# EAGLE design SCH (EAGLE 7.2.0)
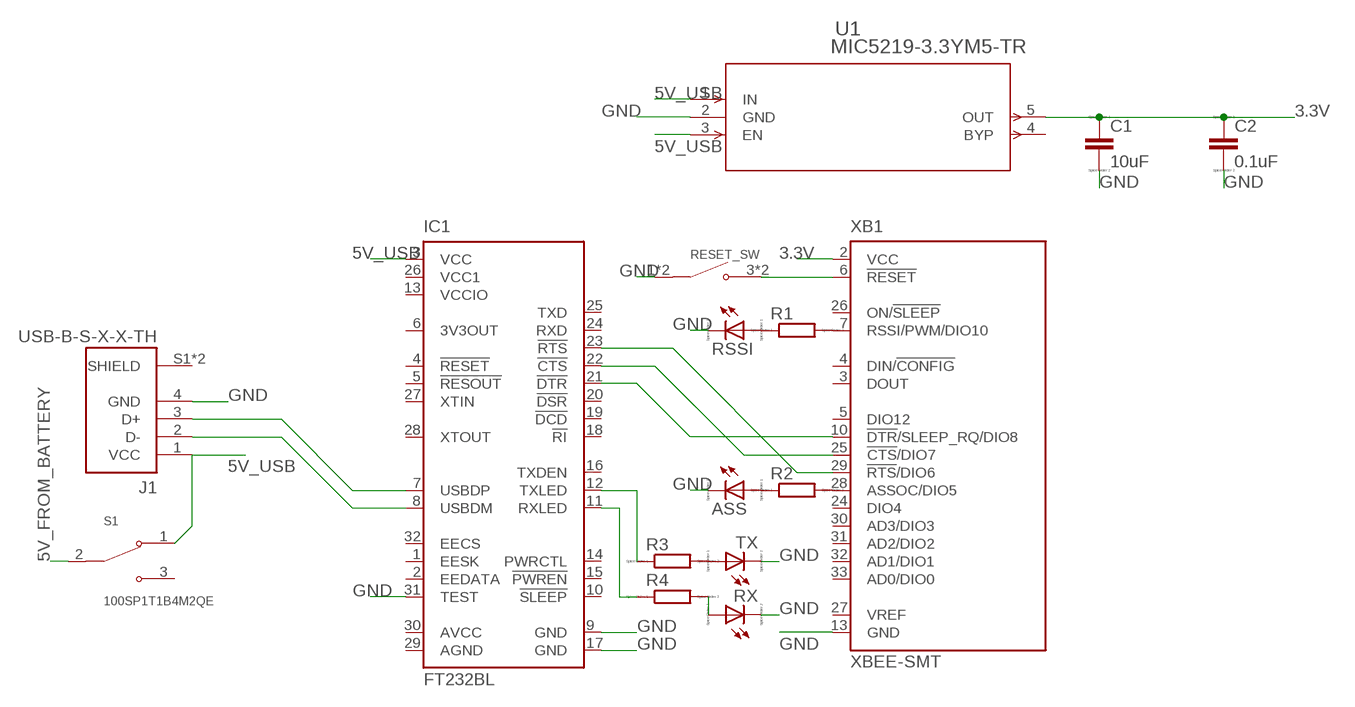
[diagram p0: schematic, sheet 1]

## Parts
ASS  LED_E  [LED_1206]
C1  10uF  C  [C0805]
C2  0.1uF  C  [C0805]
IC1  FT232BL  [LQFP32-7X7]
J1  USB-B-S-X-X-TH  [SAMTEC_USB-B-S-X-X-TH]
R1  R  [R0805]
R2  R  [R0805]
R3  R  [R0805]
R4  R  [R0805]
RESET_SW  5-1437565-0  [SW_5-1437565-0]
RSSI  LED_E  [LED_1206]
RX  LED_E  [LED_1206]
S1  100SP1T1B4M2QE  [SW_100SP1T1B4M2QE]
TX  LED_E  [LED_1206]
U1  MIC5219-3.3YM5-TR  [SOT-23-5_M5_MCH]
XB1  XBEE-SMT  [XBEE-SMT]

## Nets
3.3V: C1.1 C2.1 U1.5(OUT) XB1.2(VCC)
5V_FROM_BATTERY: S1.2
5V_USB: IC1.3(VCC) J1.1(VCC) S1.1 U1.1(IN) U1.3(EN)
GND: ASS.C C1.2 C2.2 IC1.9(GND) IC1.17(GND) IC1.31(TEST) J1.4(GND) RESET_SW.1(COM) RESET_SW.2(COM) RSSI.C RX.C TX.C U1.2(GND) XB1.13(GND)
N$1: RESET_SW.3(NO) RESET_SW.4(NO) XB1.6(!RESET)
N$2: R1.2 XB1.7(RSSI/PWM/DIO10)
N$3: IC1.7(USBDP) J1.3(D+)
N$4: IC1.8(USBDM) J1.2(D-)
N$5: IC1.23(!RTS) XB1.29(!RTS!/DIO6)
N$6: IC1.22(!CTS) XB1.25(!CTS!/DIO7)
N$7: IC1.21(!DTR) XB1.10(!DTR!/SLEEP_RQ/DIO8)
N$8: R1.1 RSSI.A
N$9: R2.2 XB1.28(ASSOC/DIO5)
N$10: ASS.A R2.1
N$11: R3.2 TX.A
N$12: R4.2 RX.A
N$13: IC1.12(TXLED) R3.1
N$14: IC1.11(RXLED) R4.1
Unconnected: IC1.1(EESK) IC1.2(EEDATA) IC1.4(!RESET) IC1.5(!RESOUT) IC1.6(3V3OUT) IC1.10(!SLEEP) IC1.14(PWRCTL) IC1.15(!PWREN) IC1.16(TXDEN) IC1.18(!RI) IC1.19(!DCD) IC1.20(!DSR) IC1.24(RXD) IC1.25(TXD) IC1.27(XTIN) IC1.28(XTOUT) IC1.32(EECS) J1.S1(SHIELD) J1.S2(SHIELD) S1.3 U1.4(BYP) XB1.3(DOUT) XB1.4(DIN/!CONFIG) XB1.5(DIO12) XB1.24(DIO4) XB1.26(ON/!SLEEP) XB1.27(VREF) XB1.30(AD3/DIO3) XB1.31(AD2/DIO2) XB1.32(AD1/DIO1) XB1.33(AD0/DIO0)

## Power pins joined to a net without a drawn wire
AGND: IC1.29(AGND)
AVCC: IC1.30(AVCC)
VCC1: IC1.26(VCC1)
VCCIO: IC1.13(VCCIO)

## Library data of the parts
ASS RSSI RX TX = eagle-ltspice:LED_E: LED Source: http://www.osram.convergy.de Source: www.luxeon.com Source: www.kingbright.com; SPICEMODEL: NONE; SPICEPREFIX: D; SPICETYPE: diode
C1 C2 = eagle-ltspice:C: CAPACITOR, European symbol; SPICEMODEL: NONE; SPICEPREFIX: C
IC1 = ftdichip:FT232B: USB to serial UART interface Source: DS_FT232BL_BQ.pdf; MF: FARNELL; MPN: FT232BL/TR; OC_FARNELL: unknown; OC_NEWARK: 38K1551
J1 = USB-B-S-X-X-TH:USB-B-S-X-X-TH: USB-B (USB TYPE-B) USB 2.0 Receptacle Connector 4 Position Through Hole, Right Angle Check availability <https://pricing.snapeda.com/parts/USB-B-S-S-B-TH/Samtec/view-part?ref=eda>; AVAILABILITY: In Stock; CHECK_PRICES: https://www.snapeda.com/parts/USB-B-S-S-B-TH/Samtec+Inc./view-part/?ref=eda; DESCRIPTION: USB-B (USB TYPE-B) USB 2.0 Receptacle Connector 4 Position Through Hole, Right Angle; MF: Samtec; MP: USB-B-S-S-B-TH; PACKAGE: None; PRICE: None; PURCHASE-URL: https://www.snapeda.com/api/url_track_click_mouser/?unipart_id=230656&manufacturer=Samtec&part_name=USB-B-S-S-B-TH&search_term=None; SNAPEDA_LINK: https://www.snapeda.com/parts/USB-B-S-S-B-TH/Samtec+Inc./view-part/?ref=snap
R1-R4 = eagle-ltspice:R: RESISTOR, European symbol; SPICEMODEL: NONE; SPICEPREFIX: R
RESET_SW = 5-1437565-0:5-1437565-0: Check availability <https://pricing.snapeda.com/parts/5-1437565-0/TE%20Connectivity/view-part?ref=eda>; AVAILABILITY: In Stock; CHECK_PRICES: https://www.snapeda.com/parts/5-1437565-0/TE+Connectivity+ALCOSWITCH+Switches/view-part/?ref=eda; COMMENT: 5-1437565-0; DESCRIPTION: Tactile Switch SPST-NO Top Actuated Surface Mount; EU_ROHS_COMPLIANCE: Compliant; MF: TE Connectivity; MP: 5-1437565-0; PACKAGE: None; PRICE: None; SNAPEDA_LINK: https://www.snapeda.com/parts/5-1437565-0/TE+Connectivity+ALCOSWITCH+Switches/view-part/?ref=snap
S1 = 100SP1T1B4M2QE:100SP1T1B4M2QE: Toggle Switch SPDT Through Hole Check availability <https://pricing.snapeda.com/parts/100SP1T1B4M2QE/E-Switch/view-part?ref=eda>; AVAILABILITY: In Stock; CHECK_PRICES: https://www.snapeda.com/parts/100SP1T1B4M2QE/E-Switch/view-part/?ref=eda; DESCRIPTION: Toggle Switch SPDT Through Hole; MF: E-Switch; MP: 100SP1T1B4M2QE; PACKAGE: None; PRICE: None; PURCHASE-URL: https://www.snapeda.com/api/url_track_click_mouser/?unipart_id=846138&manufacturer=E-Switch&part_name=100SP1T1B4M2QE&search_term=None; SNAPEDA_LINK: https://www.snapeda.com/parts/100SP1T1B4M2QE/E-Switch/view-part/?ref=snap
U1 = MIC5219:MIC5219-3.3YM5-TR; COPYRIGHT: Copyright (C) 2023 Ultra Librarian. All rights reserved.; MANUFACTURER_PART_NUMBER: MIC5219-3.3YM5-TR; MFR_NAME: Microchip
XB1 = xbee:XBEE-SMT: XBee(TM)/XBee-PRO(TM) ZB SMT RF Modules. Source: Digi (90002002_a.pdf) (http://www.digi.com/products/wireless-wired-embedded-solutions/zigbee-rf-modules/zigbee-mesh-module/xbee-smt.jsp#overview)

## Board
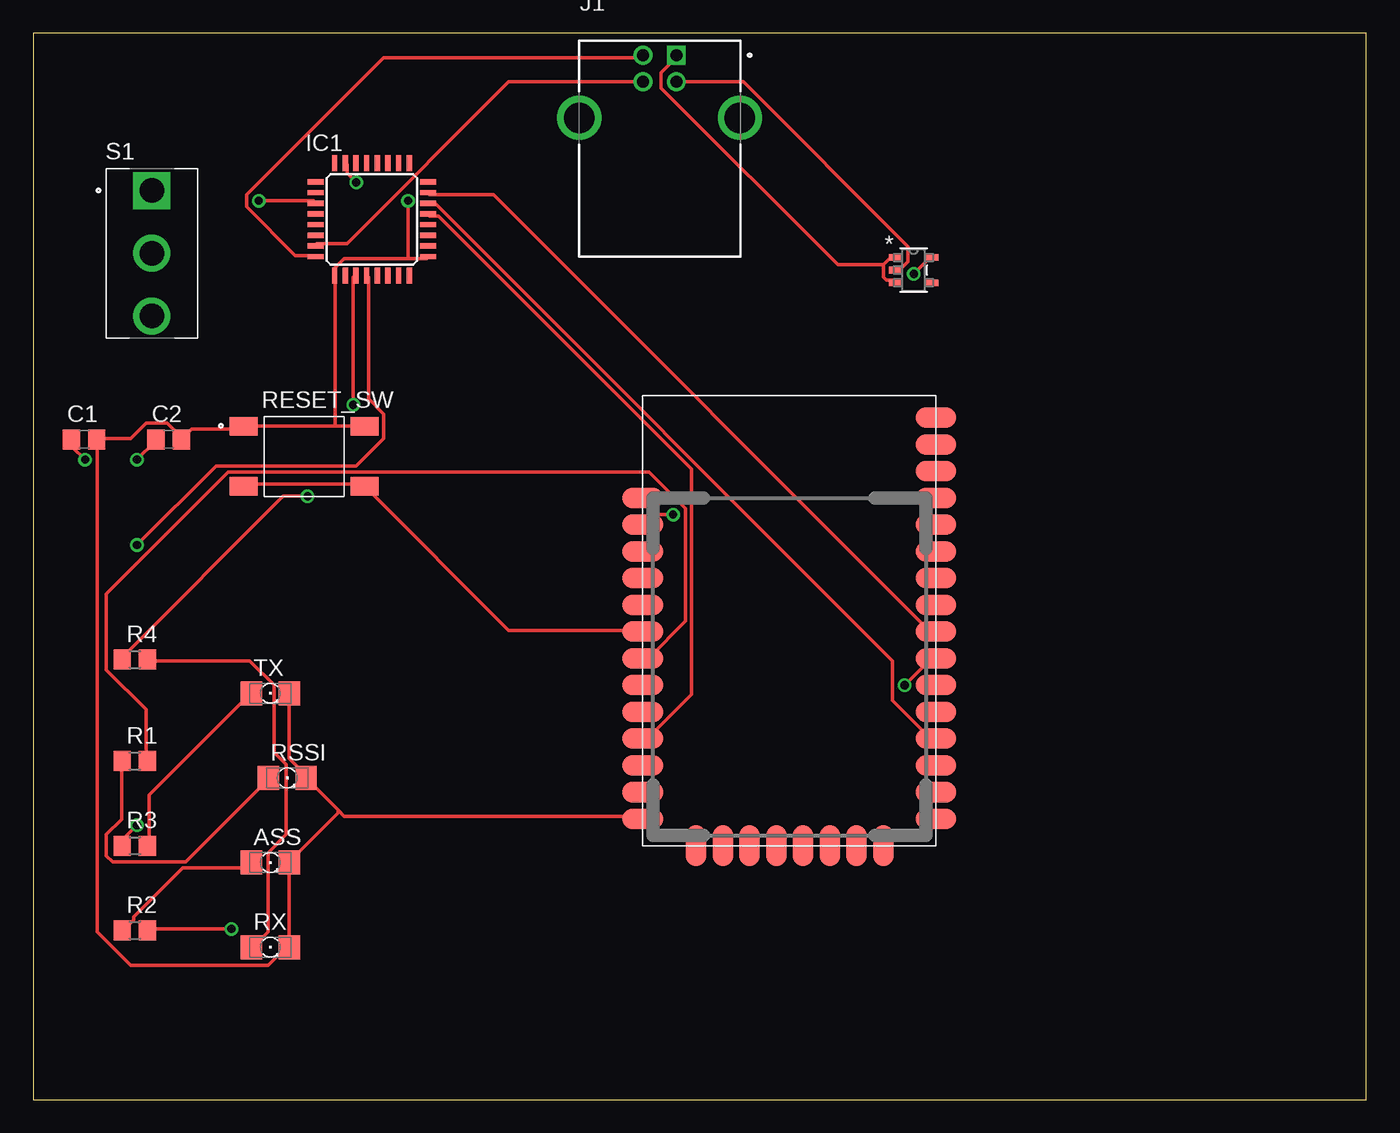
[diagram p1: board, top side]
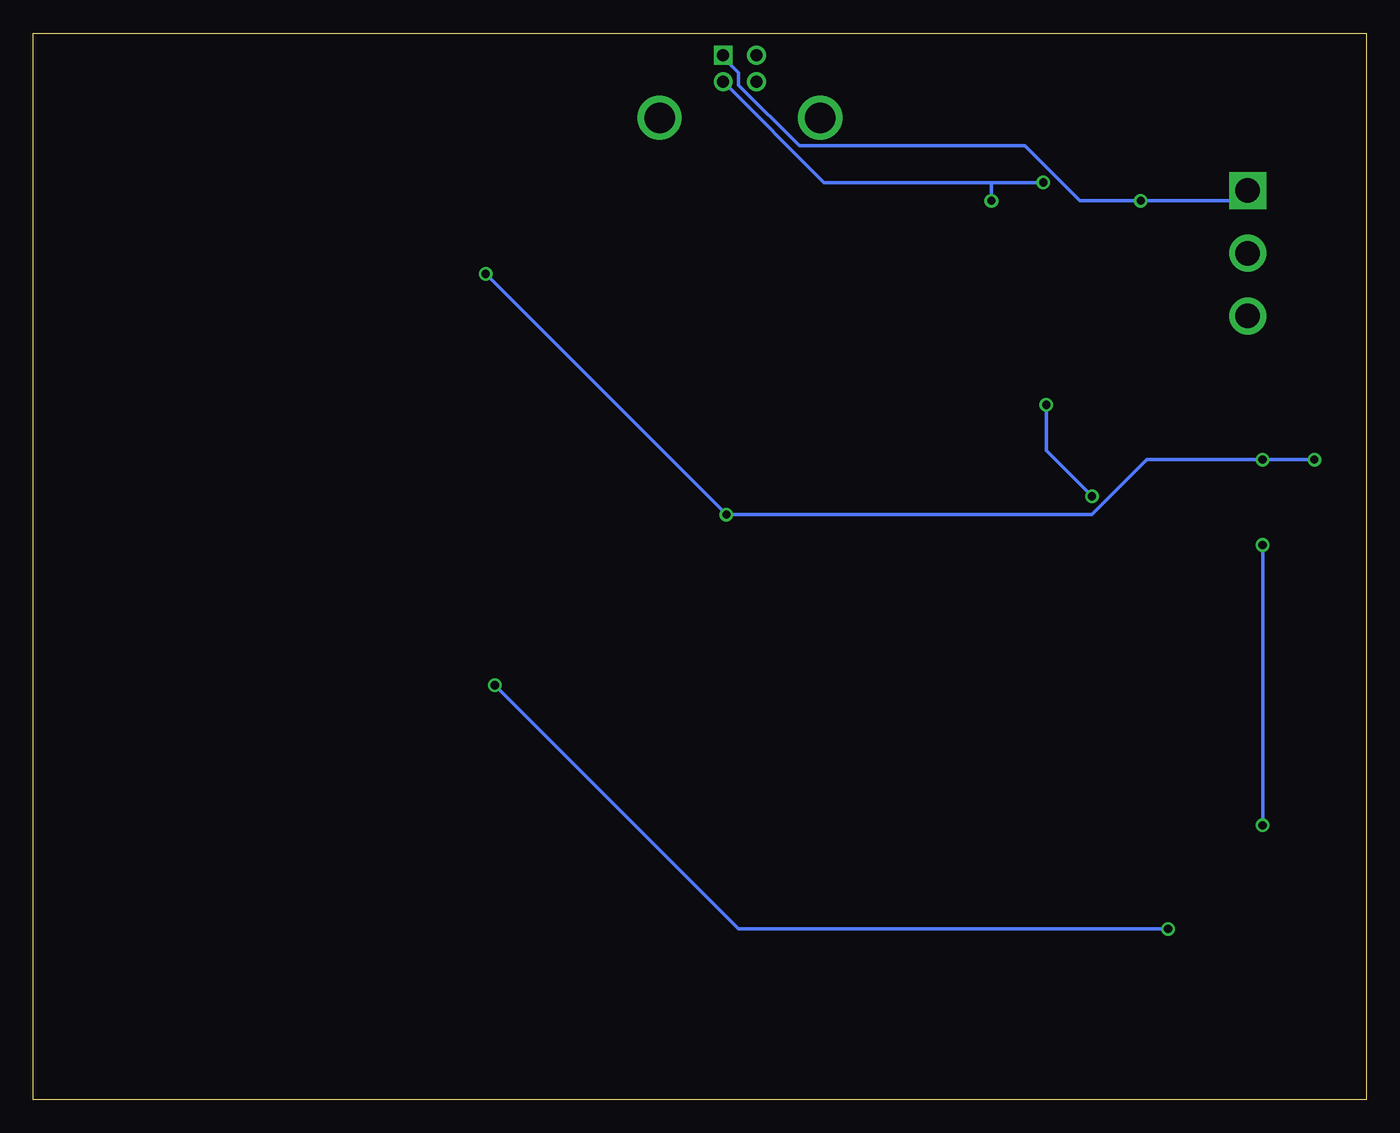
[diagram p2: board, bottom side, seen from below]

Size 100 x 80 mm. Coordinates in mm from the lower left corner, seen from the top.
Outline: 0,0 100,0 100,80 0,80 0,0
Copper layers (1*16): Top 0.035mm / dielectric 1.5mm / Bottom 0.035mm
Design rules "default": minimum track width 10mil, minimum drill 24mil, track to track 8mil, track to pad 8mil, pad to pad 8mil, via to via 8mil, smd to smd 8mil, copper to edge 40mil, drill to drill 8mil, minimum pad ring 10mil, minimum via ring 8mil, stop-mask expansion 4mil, vias tented up to drill 0mil, thermal gap 10mil

### Footprints (pad centres in the part's own frame; a part is rotated, then mirrored left to right if it is on the bottom)
LED_1206 = smd 1.6 x 1.803: A -1.422,0; C 1.422,0
C0805 = smd 1.3 x 1.5: 1 -0.95,0; 2 0.95,0
LQFP32-7X7 = smd 1.2 x 0.4: 1 -4.225,2.8; 2 -4.225,2; 3 -4.225,1.2; 4 -4.225,0.4; 5 -4.225,-0.4; 6 -4.225,-1.2; 7 -4.225,-2; 8 -4.225,-2.8; 17 4.225,-2.8; 18 4.225,-2; 19 4.225,-1.2; 20 4.225,-0.4; 21 4.225,0.4; 22 4.225,1.2; 23 4.225,2; 24 4.225,2.8 | smd 0.4 x 1.2: 9 -2.8,-4.225; 10 -2,-4.225; 11 -1.2,-4.225; 12 -0.4,-4.225; 13 0.4,-4.225; 14 1.2,-4.225; 15 2,-4.225; 16 2.8,-4.225; 25 2.8,4.225; 26 2,4.225; 27 1.2,4.225; 28 0.4,4.225; 29 -0.4,4.225; 30 -1.2,4.225; 31 -2,4.225; 32 -2.8,4.225
SAMTEC_USB-B-S-X-X-TH = drill 0.9 square: 1 1.25,4.7 | drill 0.9: 2 -1.25,4.7; 3 -1.25,2.7; 4 1.25,2.7 | drill 2.3: S1 -6.02,0; S2 6.02,0
R0805 = smd 1.3 x 1.5: 1 -0.95,0; 2 0.95,0
SW_5-1437565-0 = smd 2.1 x 1.4: 1 -4.55,2.25; 2 4.55,2.25; 3 -4.55,-2.25; 4 4.55,-2.25
SW_100SP1T1B4M2QE = drill 1.85 square: 1 0,4.7 | drill 1.85: 2 0,0; 3 0,-4.7
SOT-23-5_M5_MCH = smd 0.978 x 0.508: 1 -1.365,0.95; 2 -1.365,0; 3 -1.365,-0.95; 4 1.365,-0.95; 5 1.365,0.95
XBEE-SMT = smd 3.048 x 1.524: 1 0,26.086; 2 0,24.079; 3 0,22.073; 4 0,20.066; 5 0,18.059; 6 0,16.053; 7 0,14.046; 8 0,12.04; 9 0,10.033; 10 0,8.026; 11 0,6.02; 12 0,4.013; 13 0,2.007; 22 21.996,2.007; 23 21.996,4.013; 24 21.996,6.02; 25 21.996,8.026; 26 21.996,10.033; 27 21.996,12.04; 28 21.996,14.046; 29 21.996,16.053; 30 21.996,18.059; 31 21.996,20.066; 32 21.996,22.073; 33 21.996,24.079; 34 21.996,26.086; 35 21.996,28.092; 36 21.996,30.099; 37 21.996,32.106 | smd 1.524 x 3.048: 14 4.013,0; 15 6.02,0; 16 8.026,0; 17 10.033,0; 18 12.04,0; 19 14.046,0; 20 16.053,0; 21 18.059,0

### Placement (x,y rotation side)
ASS  17.78,17.78 0 top
C1  3.81,49.53 0 top
C2  10.16,49.53 0 top
IC1  25.4,66.04 0 top
J1  46.99,73.66 0 top
R1  7.62,25.4 0 top
R2  7.62,12.7 0 top
R3  7.62,19.05 0 top
R4  7.62,33.02 0 top
RESET_SW  20.32,48.26 0 top
RSSI  19.05,24.13 0 top
RX  17.78,11.43 0 top
S1  8.89,63.5 0 top
TX  17.78,30.48 0 top
U1  66.04,62.23 0 top
XB1  45.72,19.05 0 top

### Tracks (layer width: path | path; a pad name or v marks a point on that pad's centre or on a via)
3.3V  (via drill 0.61)
  Top 0.254: v3.89,48.01 2.97,48.92 2.97,49.38 C1.1 | v7.77,48.01 9.14,49.38 C2.1 | v66.06,61.95 67.21,63.09 U1.5 | v48.01,43.89 46.41,43.89 45.72,43.2 XB1.2
  Bottom 0.254: v3.89,48.01 v7.77,48.01 16.46,48.01 20.57,43.89 v48.01,43.89 v66.06,61.95
5V_USB  (via drill 0.61)
  Top 0.254: v16.92,67.44 21.03,67.44 IC1.3 | 63.78,62.64 63.78,61.72 64.01,61.49 64.47,61.49 U1.3 | 63.78,62.64 64.47,63.32 U1.1 | 63.78,62.64 60.35,62.64 47.09,75.89 47.09,77.04 48.23,78.18 J1.1
  Bottom 0.254: S1.1 8.91,68.12 9.6,67.44 v16.92,67.44 21.49,67.44 25.6,71.55 42.52,71.55 47.09,76.12 47.09,77.04 48.23,78.18 J1.1
GND  (via drill 0.61)
  Top 0.254: RX.C 19.2,17.6 ASS.C 19.2,17.83 22.86,21.49 22.86,21.72 | RX.C | TX.C 19.2,30.4 19.2,25.6 20.57,24.23 RSSI.C 20.57,24 22.86,21.72 | 22.86,21.72 23.32,21.26 45.72,21.26 XB1.13 | 28.12,63.09 29.49,63.09 IC1.17 | 28.12,63.09 23.32,63.09 22.63,62.41 22.63,61.95 IC1.9 22.63,61.72 22.63,50.52 | 11.2,49.61 10.06,50.75 8.46,50.75 7.32,49.61 4.8,49.61 C1.2 4.8,49.38 4.8,12.57 7.32,10.06 17.6,10.06 18.97,11.43 RX.C | 11.2,49.61 11.89,50.29 15.54,50.29 RESET_SW.1 15.77,50.52 22.63,50.52 | 11.2,49.61 C2.2 | 22.63,50.52 24.69,50.52 RESET_SW.2 | U1.2 64.69,62.41 65.15,62.41 65.61,62.87 65.61,64.01 53.26,76.35 48.46,76.35 J1.4 | v24.23,68.81 23.55,69.49 23.55,70.18 IC1.31 | v28.12,67.44 28.12,63.09
  Bottom 0.254: 28.12,68.81 40.69,68.81 J1.4 | 28.12,68.81 v24.23,68.81 | 28.12,68.81 v28.12,67.44
N$1
  Top 0.254: RESET_SW.3 15.77,46.18 24.69,46.18 RESET_SW.4 24.92,45.95 35.66,35.2 45.72,35.2 XB1.6
N$2
  Top 0.254: R1.2 8.46,25.6 8.46,29.26 5.49,32.23 5.49,37.95 14.63,47.09 46.18,47.09 48.92,44.35 48.92,35.89 46.18,33.15 45.72,33.15 XB1.7
N$3
  Top 0.254: IC1.7 21.26,64.24 23.55,64.24 35.66,76.35 45.72,76.35 J1.3
N$4
  Top 0.254: IC1.8 21.03,63.32 19.66,63.32 16,66.98 16,67.89 26.29,78.18 45.72,78.18 J1.2
N$5
  Top 0.254: IC1.23 29.72,67.89 34.52,67.89 67.21,35.2 67.67,35.2 XB1.29
N$6
  Top 0.254: IC1.22 29.72,67.21 30.18,67.21 64.47,32.92 64.47,29.95 67.21,27.2 67.67,27.2 XB1.25
N$7
  Top 0.254: IC1.21 29.72,66.29 30.4,66.29 49.38,47.32 49.38,30.4 46.18,27.2 45.72,27.2 XB1.10
N$8
  Top 0.254: R1.1 6.63,25.38 6.63,21.03 5.49,19.89 5.49,18.29 5.94,17.83 11.43,17.83 17.6,24 RSSI.A
N$9  (via drill 0.61)
  Top 0.254: v14.86,12.8 8.69,12.8 R2.2 | v65.38,31.09 67.21,32.92 67.67,32.92 XB1.28
  Bottom 0.254: v14.86,12.8 47.09,12.8 v65.38,31.09
N$10
  Top 0.254: R2.1 6.86,12.8 7.54,13.49 7.54,13.72 11.2,17.37 16,17.37 16.23,17.6 ASS.A
N$11
  Top 0.254: R3.2 8.69,19.2 8.69,22.86 16.23,30.4 TX.A
N$12
  Top 0.254: R4.2 8.69,32.92 16.23,32.92 18.06,31.09 18.06,26.06 18.97,25.15 18.97,19.89 17.6,18.52 17.6,12.57 16.46,11.43 RX.A
N$13  (via drill 0.61)
  Top 0.254: v7.77,41.6 13.72,47.55 24.23,47.55 26.29,49.61 26.29,51.44 25.15,52.58 25.15,61.72 IC1.12 | v7.77,20.57 6.86,19.66 6.86,19.2 R3.1
  Bottom 0.254: v7.77,20.57 v7.77,41.6
N$14  (via drill 0.61)
  Top 0.254: v24,52.12 24,61.72 IC1.11 | v20.57,45.26 18.75,45.26 6.63,33.15 R4.1
  Bottom 0.254: v24,52.12 24,48.69 v20.57,45.26